# Altium project pami_groupie.PrjPcb
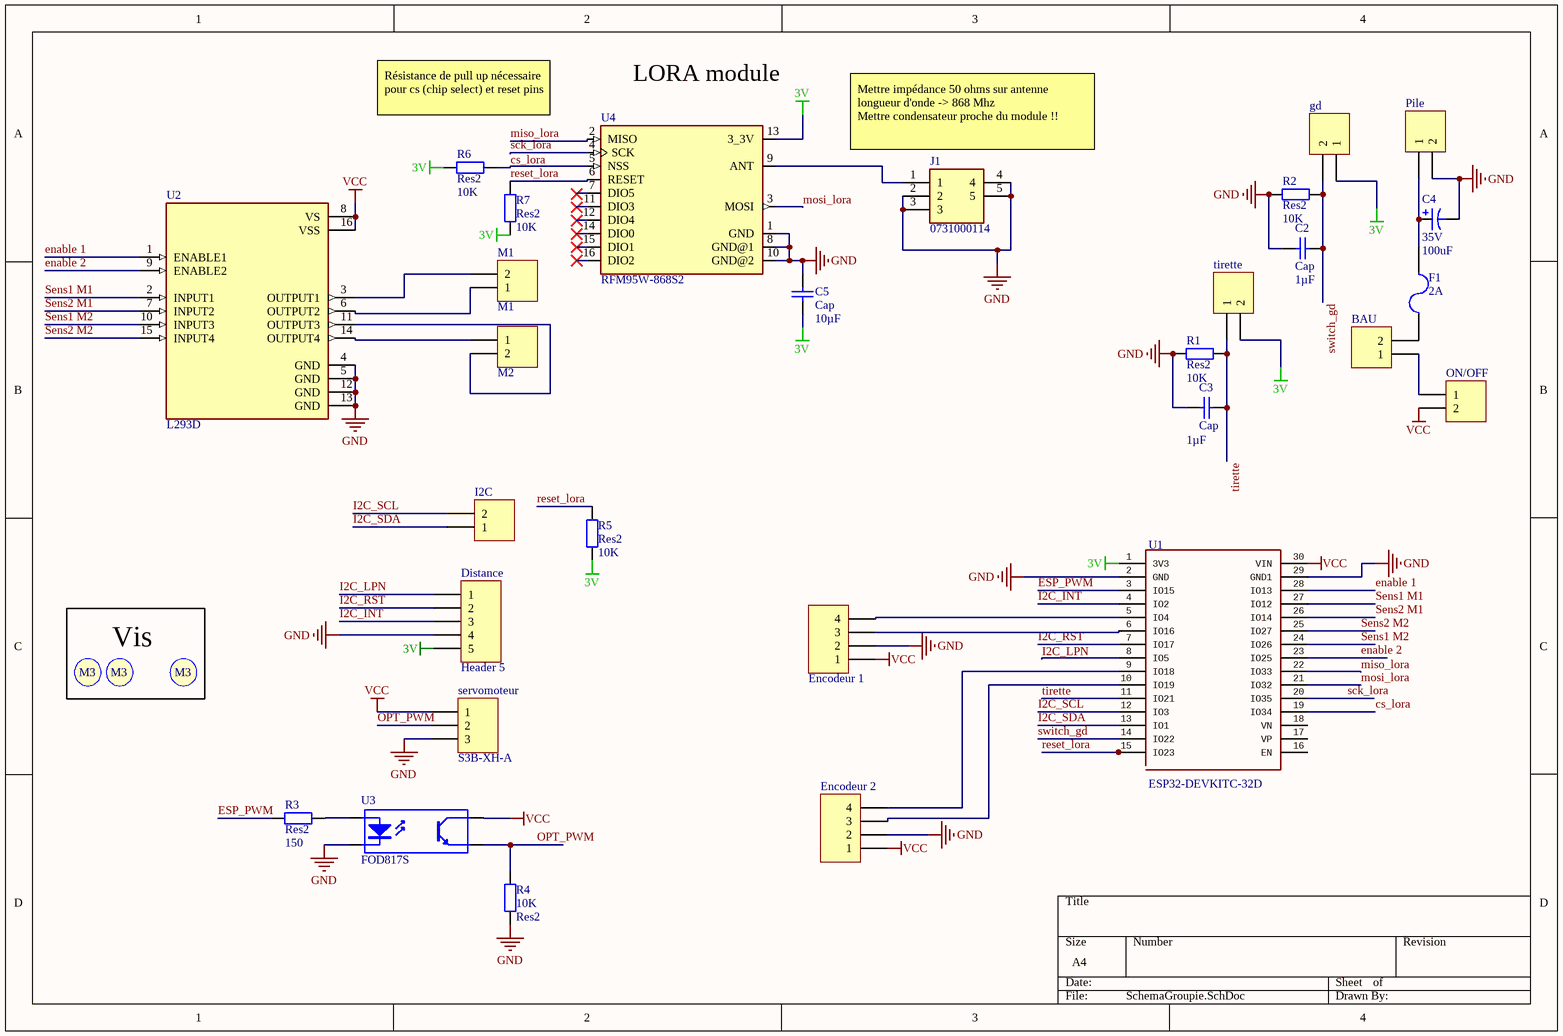
[diagram p0: SchemaGroupie.SchDoc]
1 sheet, 32 parts. Net scope: global (net labels, ports and power ports of the same name join across sheets).
Board file: PCBGroupie.PcbDoc

## Sheet SchemaGroupie.SchDoc
size A4; SheetNumber: 1; SheetTotal: 1

### Parts
BAU  (no value)  [S2B-XH-A]
C2  Cap  value 1µF  [Capacitor 1206]
C3  Cap  value 1µF  [Capacitor 1206]
C4  35V  value 100uF  [Condensateur]
C5  Cap  value 10µF  [Capacitor 1206]
Distance  Header 5  [B5BXHAMLFSN]
Encodeur_1  (no value)  [B4BXHALFSN]
Encodeur_2  (no value)  [B4BXHALFSN]
F1  2A  [Fuse]
gd  (no value)  [S2B-XH-A]
I2C  (no value)  [S2B-XH-A]
J1  0731000114  [0731000114]
M1  M1  [S2B-XH-A]
M2  M2  [S2B-XH-A]
ON/OFF  (no value)  [S2B-XH-A]
Pile  (no value)  [S2B-XH-A]
R1  Res2  value 10K  [Resistor 1206]
R2  Res2  value 10K  [Resistor 1206]
R3  Res2  value 150  [Resistor 1206]
R4  Res2  value 10K  [Resistor 1206]
R5  Res2  value 10K  [Resistor 1206]
R6  Res2  value 10K  [Resistor 1206]
R7  Res2  value 10K  [Resistor 1206]
S1  Screw M3  [Screw M3]  (value not drawn)
S2  Screw M3  [Screw M3]  (value not drawn)
S4  Screw M3  [Screw M3]  (value not drawn)
servomoteur  S3B-XH-A  [S3B-XH-A]
tirette  (no value)  [S2B-XH-A]
U1  ESP32-DEVKITC-32D  [MODULE_ESP32-DEVKITV1]
U2  L293D  [DIP880W50P254L2000H510Q16]
U3  FOD817S  [SOP254P1016X385-4N]
U4  RFM95W-868S2  [XCVR_RFM95W-868S2]

### Nets
3V: C5.1 Distance.5 gd.1 R5.1 R6.1 R7.1 tirette.2 U1.1(3V3) U4.13(3_3V)
GND: C2.1 C3.1 C4.2 C5.2 Distance.4 Encodeur_1.2 Encodeur_2.2 J1.2 J1.3 J1.4 J1.5 Pile.2 R1.1 R2.1 R4.1 servomoteur.3 U1.2(GND) U1.29(GND1) U2.4(GND) U2.5(GND) U2.12(GND) U2.13(GND) U3.2(K) U4.1(GND) U4.8(GND@1) U4.10(GND@2)
VCC: Encodeur_1.1 Encodeur_2.1 ON/OFF.2 servomoteur.1 U1.30(VIN) U2.8(VS) U2.16(VSS) U3.4(C)
cs_lora: R6.2 U1.19(IO34) U4.5(NSS)
enable 1: U1.28(IO13) U2.1(ENABLE1)
enable 2: U1.23(IO25) U2.9(ENABLE2)
ESP_PWM: R3.1 U1.3(IO15)
I2C_INT: Distance.3 U1.4(IO2)
I2C_LPN: Distance.1 U1.8(IO5)
I2C_RST: Distance.2 U1.7(IO17)
I2C_SCL: I2C.2 U1.12(IO3)
I2C_SDA: I2C.1 U1.13(IO1)
miso_lora: U1.22(IO33) U4.2(MISO)
mosi_lora: U1.21(IO32) U4.3(MOSI)
OPT_PWM: R4.2 servomoteur.2 U3.3(E)
reset_lora: R5.2 R7.2 U1.15(IO23) U4.6(RESET)
sck_lora: U1.20(IO35) U4.4(SCK)
Sens1 M1: U1.27(IO12) U2.2(INPUT1)
Sens1 M2: U1.24(IO26) U2.10(INPUT3)
Sens2 M1: U1.26(IO14) U2.7(INPUT2)
Sens2 M2: U1.25(IO27) U2.15(INPUT4)
switch_gd: C2.2 gd.2 R2.2 U1.14(IO22)
tirette: C3.2 R1.2 tirette.1 U1.11(IO21)
NetBAU_1: BAU.1 ON/OFF.1
NetBAU_2: BAU.2 F1.1
NetC4_1: C4.1 F1.2 Pile.1
NetEncodeur_1_3: Encodeur_1.3 U1.6(IO16)
NetEncodeur_1_4: Encodeur_1.4 U1.5(IO4)
NetEncodeur_2_3: Encodeur_2.3 U1.10(IO19)
NetEncodeur_2_4: Encodeur_2.4 U1.9(IO18)
NetJ1_1: J1.1 U4.9(ANT)
NetM1_1: M1.1 U2.6(OUTPUT2)
NetM1_2: M1.2 U2.3(OUTPUT1)
NetM2_1: M2.1 U2.14(OUTPUT4)
NetM2_2: M2.2 U2.11(OUTPUT3)
NetR3_2: R3.2 U3.1(A)

Not connected (* = marked no-connect by the designer): U1 16(EN) 17(VP) 18(VN); U4 7(DIO5)* 11(DIO3)* 12(DIO4)* 14(DIO0)* 15(DIO1)* 16(DIO2)*

### Notes on the sheet
- Résistance de pull up nécessaire pour cs (chip select) et reset pins
- (near U4) LORA module
- (near J1) Mettre impédance 50 ohms sur antenne
  longueur d'onde -> 868 Mhz
  Mettre condensateur proche du module !!
- Vis
- (in symbol Screw M3) M3

### Library data of the parts
BAU gd I2C M1 M2 ON/OFF Pile tirette = Header 2H: Header, 2-Pin, Right Angle; LatestRevisionDate: 17-Jul-2002; LatestRevisionNote: Re-released for DXP Platform.; Publisher: Altium Limited
C2 C3 C5 = Cap: Capacitor; Published: 8-Jun-2000; LatestRevisionDate: 17-Jul-2002; LatestRevisionNote: Re-released for DXP Platform.; PackageReference: RAD-0.3; Publisher: Altium Limited; PackageDescription: Radial Cap, Thru-Hole; 2 Leads; 0.3 in Pin Spacing
C4 = Cap Pol1: Polarized Capacitor (Radial); Published: 8-Jun-2000; LatestRevisionDate: 17-Jul-2002; LatestRevisionNote: Re-released for DXP Platform.; PackageReference: RB7.6-15; Publisher: Altium Limited; PackageDescription: Polarized Capacitor (Radial); 2 Leads
Distance = Header 5: Header, 5-Pin; LatestRevisionDate: 17-Jul-2002; LatestRevisionNote: Re-released for DXP Platform.; Publisher: Altium Limited
Encodeur_1 Encodeur_2 = Header 4H: Header, 4-Pin, Right Angle; LatestRevisionDate: 17-Jul-2002; LatestRevisionNote: Re-released for DXP Platform.; Publisher: Altium Limited
F1 = Fuse 2: Fuse; Published: 8-Jun-2000; LatestRevisionDate: 17-Jul-2002; LatestRevisionNote: Re-released for DXP Platform.; PackageReference: PIN-W2/E2.8; Publisher: Altium Limited; PackageDescription: Thru-Hole; 2 Leads
J1 = 0731000114: Connector; Manufacturer_Name: Molex; Datasheet Link: https://www.molex.com/pdm_docs/sd/731000114_sd.pdf; Height: 9.57mm; Manufacturer_Part_Number: 0731000114; Mouser Part Number: N/A; Mouser Price/Stock: https://www.mouser.co.uk/ProductDetail/Molex/0731000114?qs=PBcRNPEHKspjQWXqYv3LPw%3D%3D; Arrow Part Number: 0731000114; Arrow Price/Stock: https://www.arrow.com/en/products/0731000114/molex?region=europe
R1-R7 = Res2: Resistor; Published: 8-Jun-2000; LatestRevisionDate: 17-Jul-2002; LatestRevisionNote: Re-released for DXP Platform.; PackageReference: AXIAL-0.4; Publisher: Altium Limited; PackageDescription: Axial Device, Thru-Hole; 2 Leads; 0.4 in Pin Spacing
servomoteur = Header 3H: Header, 3-Pin, Right Angle; LatestRevisionDate: 17-Jul-2002; LatestRevisionNote: Re-released for DXP Platform.; Publisher: Altium Limited
U1 = ESP32-DEVKITC-32D: Eval Board For Esp-Wroom-32; MF: Espressif Systems; Availability: Unavailable; Package: None; SnapEDA_Link: https://www.snapeda.com/parts/ESP32-DEVKITC-32D/Espressif%20Systems/view-part/?ref=snap; MP: ESP32-DEVKITC-32D; Price: None; Value: *
U2 = L293D: Bipolar Motor Driver - Parallel 16-PowerDIP; MF: STMicroelectronics; MP: L293D; Package: DIP-16 STMicroelectronics; SnapEDA_Link: https://www.snapeda.com/parts/L293D/STMicroelectronics/view-part/?ref=snap; Purchase-URL: https://pricing.snapeda.com/search/part/L293D/?ref=eda; Check_prices: https://www.snapeda.com/parts/L293D/STMicroelectronics/view-part/?ref=eda; Availability: In Stock; Value: *; Price: None
U3 = Optoisolator1: 4-Pin Phototransistor Optocoupler; Published: 24-Mar-1999; LatestRevisionDate: 04-Mar-2005; LatestRevisionNote: Sch pins 3 & 4 Swapped.; DatasheetVersion: Nov-2003; PackageReference: DIP-4; Publisher: Altium Limited
U4 = RFM95W-868S2: General ISM < 1GHz LoRaâ„¢ Transceiver Module 868MHz Antenna Not Included Surface Mount; MF: RF; Package: Non Standard RF Solutions; Price: None; Check_prices: https://www.snapeda.com/parts/RFM95W-868S2/RF+Solutions/view-part/?ref=eda; Value: *; SnapEDA_Link: https://www.snapeda.com/parts/RFM95W-868S2/RF+Solutions/view-part/?ref=snap; MP: RFM95W-868S2; Availability: In Stock; Purchase-URL: https://pricing.snapeda.com/search?q=RFM95W-868S2&ref=eda